# EAGLE design Badge_v0 (EAGLE 9.4.2)
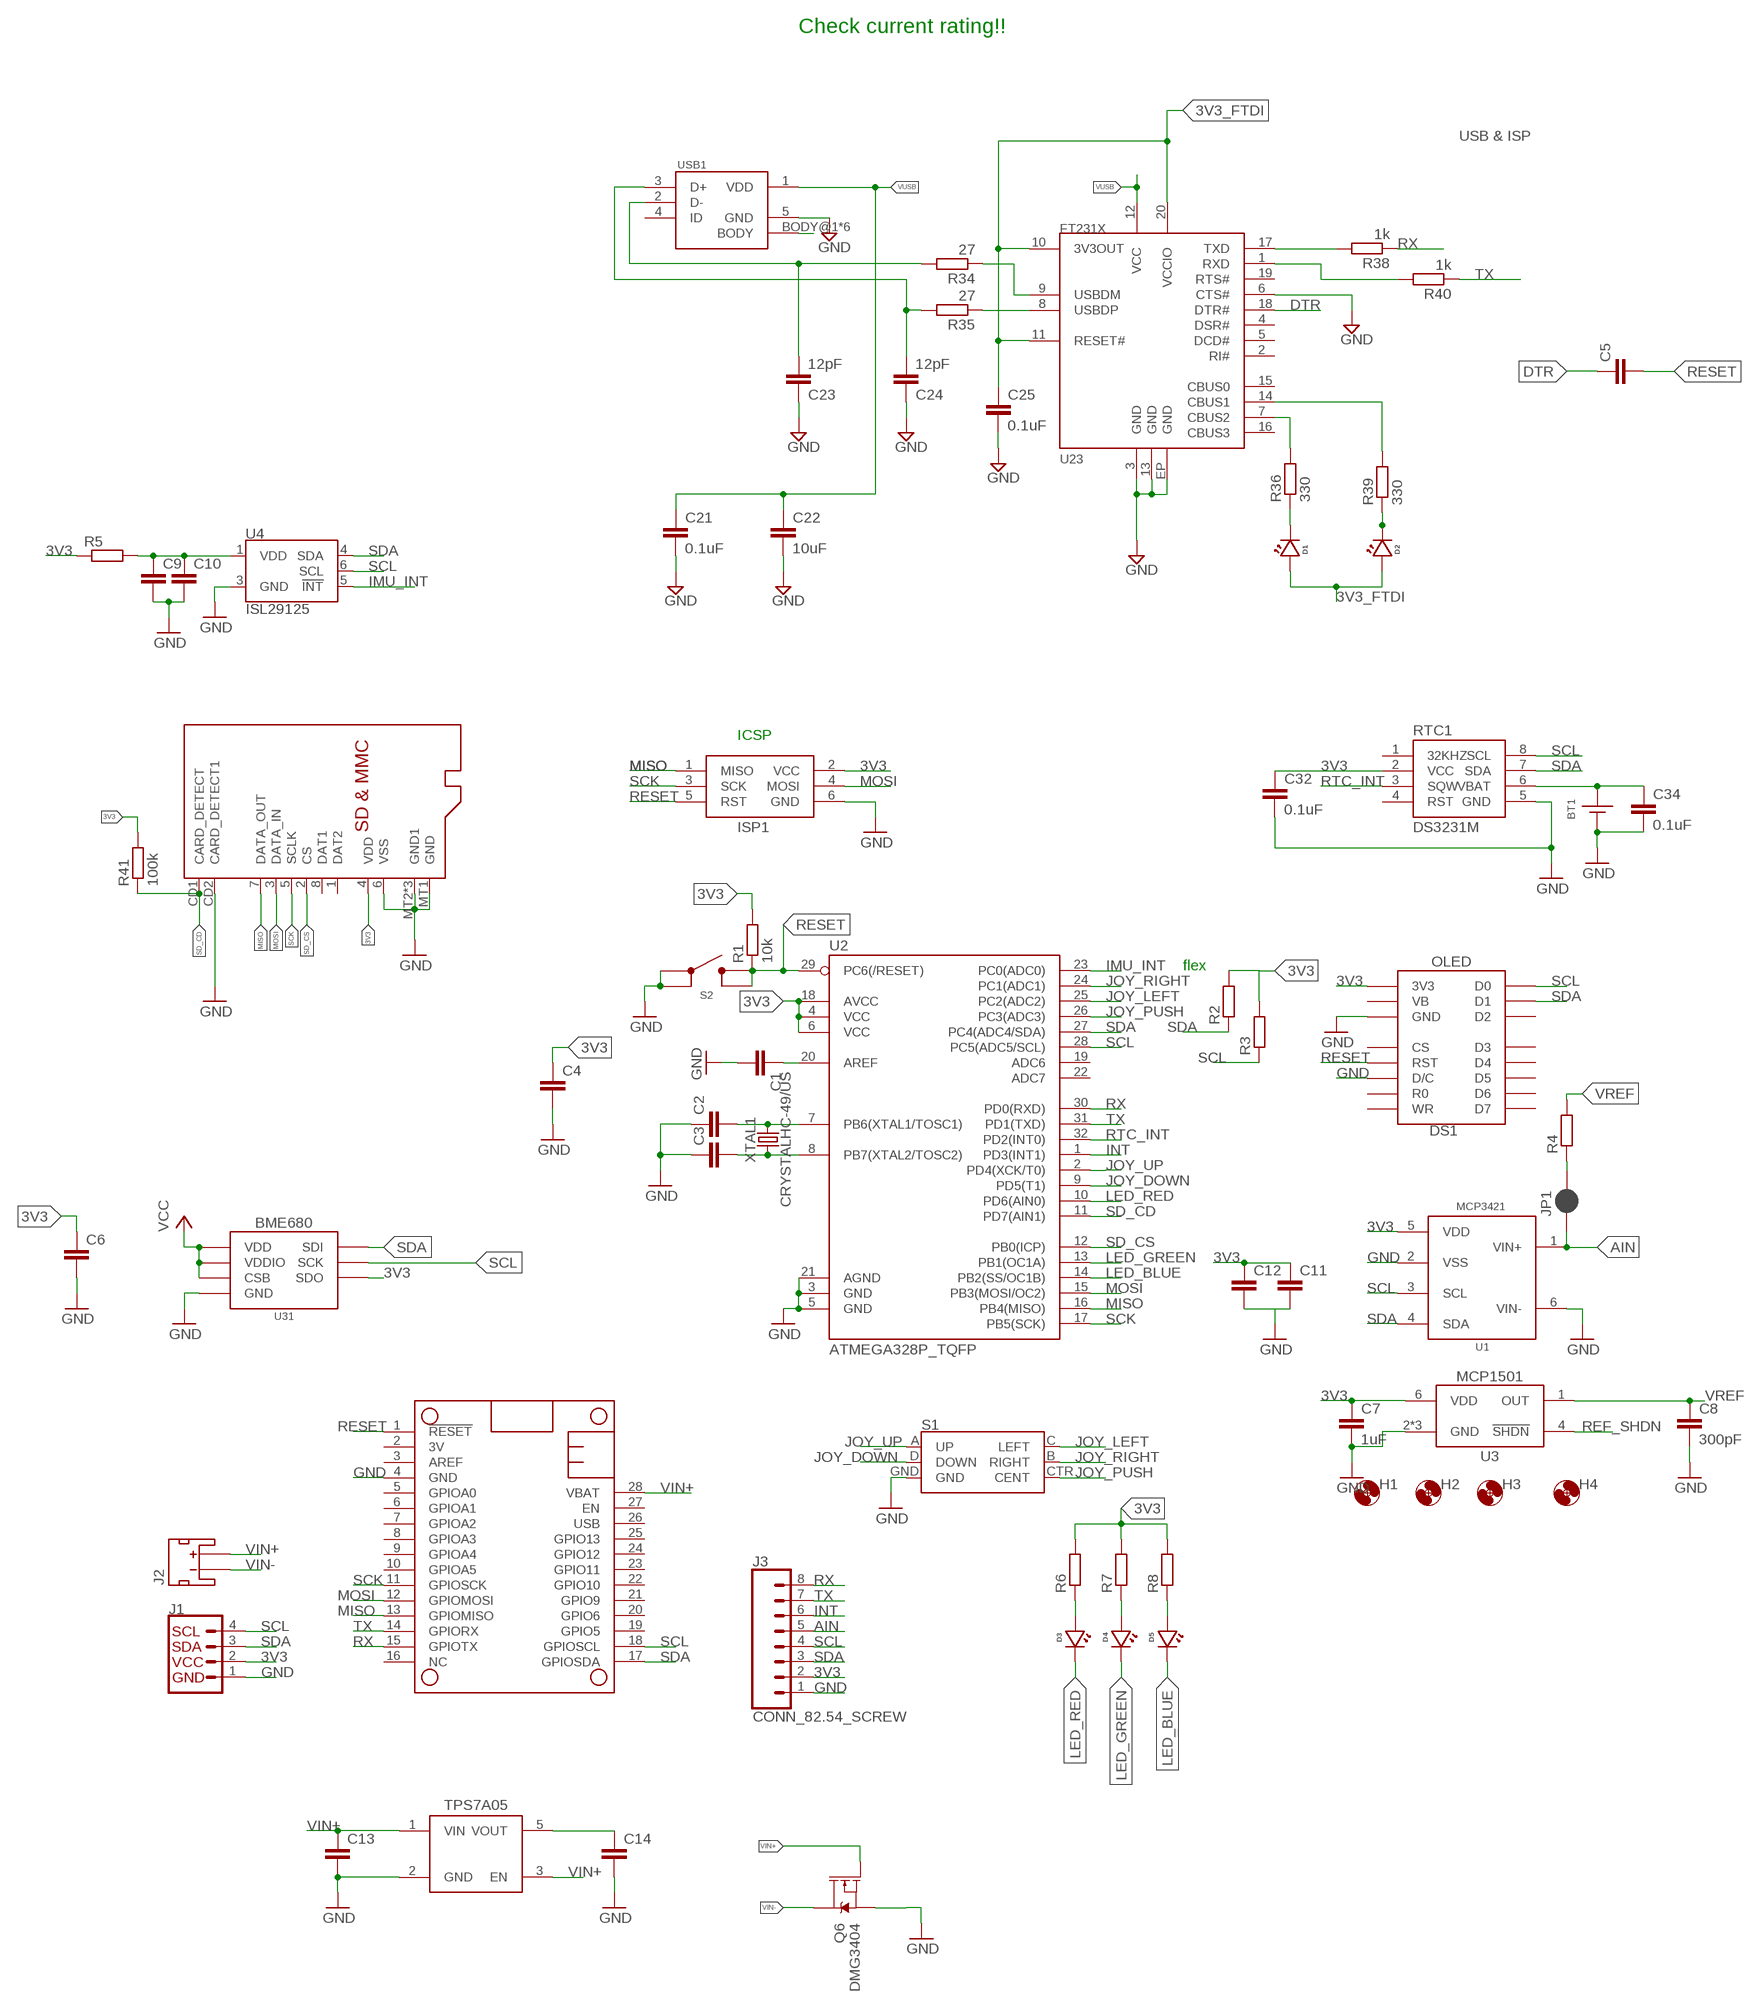
[diagram p0: schematic, sheet 1]

## Parts
BT1  BATTERY_COIN12MM  [LINX_BAT-HLD-012-SMT]
C1  C-EU0.1UFC0603  [C0603]
C2  C-EUC0603  [C0603]
C3  C-EUC0603  [C0603]
C4  C-EU1UFC0603  [C0603]
C5  C-EU0.1UFC0402  [C0402]
C6  C-EU0.1UFC0603  [C0603]
C7  1uF  C-EU1UFC0603  [C0603]
C8  300pF  C-EUC0603  [C0603]
C9  C-EU1UFC0603  [C0603]
C10  C-EU0.1UFC0603  [C0603]
C11  C-EU0.1UFC0603  [C0603]
C12  C-EU10UFC0805  [C0805]
C13  C-EU1UFC0603  [C0603]
C14  C-EU1UFC0603  [C0603]
C21  0.1uF  C-EU0.1UFC0402  [C0402]
C22  10uF  C-EU10UFC0805  [C0805]
C23  12pF  C-EU12PFC0402  [C0402]
C24  12pF  C-EU12PFC0402  [C0402]
C25  0.1uF  C-EU0.1UFC0402  [C0402]
C32  0.1uF  C-EU0.1UFC0402  [C0402]
C34  0.1uF  C-EU0.1UFC0402  [C0402]
D1  LED0402  [LED_0402]
D2  LED0402  [LED_0402]
D3  LED0402  [LED_0402]
D4  LED0402  [LED_0402]
D5  LED0402  [LED_0402]
DS1  SAPRKFUN_MICRO_OLED  [SPARKFUN_MICRO_OLED]
H1  MOUNTING_HOLE4_PL  [4_40_PLATED]
H2  MOUNTING_HOLE4_PL  [4_40_PLATED]
H3  MOUNTING_HOLE4_PL  [4_40_PLATED]
H4  MOUNTING_HOLE4_PL  [4_40_PLATED]
ISP1  AVRISP-6  [AVRISP]
J1  QWIIC_CONNECTORJS-1MM  [1X04_1MM_RA]
J2  JST_2MM_MALE  [JST-2-SMD]
J3  CONN_82.54_SCREW  [1X08_SCREW]
JP1  JUMPER-SMT_2_NC_PASTE_SILK  [SMT-JUMPER_2_NC_PASTE_SILK]
MS1  FEATHERWINGLAYOUT  [FEATHERWING_MIN]
Q6  DMG3404  MOSFET-NCH-DMG3404L  [SOT23-3]
R1  10k  R-EU_10KR0603  [R0603]
R2  R-EU_10KR0603  [R0603]
R3  R-EU_10KR0603  [R0603]
R4  R-EU_P10KR0603  [R0603]
R5  R-EU_R0603  [R0603]
R6  R-EU_330R0402  [R0402]
R7  R-EU_330R0402  [R0402]
R8  R-EU_330R0402  [R0402]
R34  27  R-EU_27R0402  [R0402]
R35  27  R-EU_27R0402  [R0402]
R36  330  R-EU_330R0402  [R0402]
R38  1k  R-EU_330R0402  [R0402]
R39  330  R-EU_330R0402  [R0402]
R40  1k  R-EU_330R0402  [R0402]
R41  100k  R-EU_10KR0402  [R0402]
RTC1  DS3231M  [SO08]
S1  JOYSTICK_MINI  [JOYSTICK_MINI]
S2  BUTTON  [SWITCH_6MM]
SD2  MICROSDCD  [MICROSD_CD]
U1  MCP3421A3  [SOT23-6L]
U2  ATMEGA328P_TQFP  ATMEGA328P_TQFPTQFP_32  [TQFP32-08]
U3  MCP15012.5V  [SOT23-6L]
U4  ISL29125  [ODFN-6]
U5  TPS7A0533DBV  [SOT23-5]
U23  FT231X-Q  [QFN20]
U31  BME680  [BMP680]
USB1  MICRO_USB_LONGPADS  [10118194-0001LF_10118194-0001LF_LONGER_PADS]
XTAL1  CRYSTALHC-49/US  [HC49UP]

## Nets
3V3: C4.1 C6.1 C7.1 C11.1 C12.1 C14.1 C32.1 DS1.VDD(3V3) ISP1.2(VCC) J1.2(VCC) J3.2 R1.2 R2.2 R3.2 R5.1 R6.2 R7.2 R8.2 R41.2 RTC1.2(VCC) SD2.4(VDD) U1.5(VDD) U2.4(VCC) U2.6(VCC) U2.18(AVCC) U3.6(VDD) U5.5(VOUT) U31.2(CSB) U31.5(SDO) U31.6(VDDIO) U31.8(VDD) ; supply symbol labelled VCC
3V3_FTDI: C25.1 D1.ANODE D2.ANODE U23.10(3V3OUT) U23.11(RESET#) U23.20(VCCIO)
AIN: J3.5 JP1.1 U1.1(VIN+)
DTR: C5.1 U23.18(DTR#)
GND: BT1.GND(-) C1.2 C2.1 C3.1 C4.2 C6.2 C7.2 C8.2 C9.2 C10.2 C11.2 C12.2 C13.2 C14.2 C21.2 C22.2 C23.1 C24.1 C25.2 C32.2 C34.2 DS1.D/C DS1.GND ISP1.6(GND) J1.1(GND) J3.1 MS1.4(GND) Q6.2(S) RTC1.5(GND) S1.GND S2.1 S2.2 SD2.6(VSS) SD2.CD2(CARD_DETECT1) SD2.MT1(GND) SD2.MT2(GND1) SD2.MT3(GND1) SD2.MT4(GND1) U1.2(VSS) U1.6(VIN-) U2.3(GND) U2.5(GND) U2.21(AGND) U3.2(GND) U3.3(GND) U3.5(GND) U4.3(GND) U5.2(GND) U23.3(GND) U23.6(CTS#) U23.13(GND) U23.EP(GND) U31.1(GND) U31.7(GND) USB1.5(GND)
IMU_INT: U2.23(PC0(ADC0)) U4.5(!INT)
INT: J3.6 U2.1(PD3(INT1))
JOY_DOWN: S1.D(DOWN) U2.9(PD5(T1))
JOY_LEFT: S1.C(LEFT) U2.25(PC2(ADC2))
JOY_PUSH: S1.CTR(CENT) U2.26(PC3(ADC3))
JOY_RIGHT: S1.B(RIGHT) U2.24(PC1(ADC1))
JOY_UP: S1.A(UP) U2.2(PD4(XCK/T0))
LED_BLUE: D5.CATHODE U2.14(PB2(SS/OC1B))
LED_GREEN: D4.CATHODE U2.13(PB1(OC1A))
LED_RED: D3.CATHODE U2.10(PD6(AIN0))
MISO: ISP1.1(MISO) MS1.13(GPIOMISO) SD2.7(DATA_OUT) U2.16(PB4(MISO))
MOSI: ISP1.4(MOSI) MS1.12(GPIOMOSI) SD2.3(DATA_IN) U2.15(PB3(MOSI/OC2))
N$1: USB1.BODY@1(BODY) USB1.BODY@2(BODY) USB1.BODY@3(BODY) USB1.BODY@4(BODY) USB1.BODY@7(BODY) USB1.BODY@8(BODY)
N$2: JP1.2 R4.1
N$3: C9.1 C10.1 R5.2 U4.1(VDD)
N$5: C1.1 U2.20(AREF)
N$7: C3.2 U2.8(PB7(XTAL2/TOSC2)) XTAL1.1
N$8: C2.2 U2.7(PB6(XTAL1/TOSC1)) XTAL1.2
N$10: D3.ANODE R6.1
N$11: D4.ANODE R7.1
N$12: D5.ANODE R8.1
N$43: BT1.POWER0(+) BT1.POWER1(+) C34.1 RTC1.6(VBAT)
N$44: R38.2 U23.17(TXD)
N$47: R40.2 U23.1(RXD)
N$48: C24.2 R35.2 USB1.3(D+)
N$49: C23.2 R34.2 USB1.2(D-)
N$50: R35.1 U23.8(USBDP)
N$51: R39.2 U23.14(CBUS1)
N$52: R34.1 U23.9(USBDM)
N$53: D2.CATHODE R39.1
N$54: D1.CATHODE R36.1
N$57: R36.2 U23.7(CBUS2)
REF_SHDN: U3.4(!SHDN)
RESET: C5.2 DS1.RESET(RST) ISP1.5(RST) MS1.1(!RESET) R1.1 S2.3 S2.4 U2.29(PC6(/RESET))
RTC_INT: RTC1.3(SQW) U2.32(PD2(INT0))
RX: J3.8 MS1.15(GPIOTX) R38.1 U2.30(PD0(RXD))
SCK: ISP1.3(SCK) MS1.11(GPIOSCK) SD2.5(SCLK) U2.17(PB5(SCK))
SCL: DS1.D0/SCK(D0) J1.4(SCL) J3.4 MS1.18(GPIOSCL) R3.1 RTC1.8(SCL) U1.3(SCL) U2.28(PC5(ADC5/SCL)) U4.6(SCL) U31.4(SCK)
SD_CD: R41.1 SD2.CD1(CARD_DETECT) U2.11(PD7(AIN1))
SD_CS: SD2.2(CS) U2.12(PB0(ICP))
SDA: DS1.D1/MOSI(D1) J1.3(SDA) J3.3 MS1.17(GPIOSDA) R2.1 RTC1.7(SDA) U1.4(SDA) U2.27(PC4(ADC4/SDA)) U4.4(SDA) U31.3(SDI)
TX: J3.7 MS1.14(GPIORX) R40.1 U2.31(PD1(TXD))
VIN+: C13.1 J2.2(+) MS1.28(VBAT) Q6.1(G) U5.1(VIN) U5.3(EN)
VIN-: J2.1(-) Q6.3(D)
VREF: C8.1 R4.2 U3.1(OUT)
VUSB: C21.1 C22.1 U23.12(VCC) USB1.1(VDD)
Unconnected: DS1.CS DS1.D2 DS1.D3 DS1.D4 DS1.D5 DS1.D6 DS1.D7 DS1.RD/E(R0) DS1.WR/RW(WR) J2.NC1(PAD1) J2.NC2(PAD2) MS1.2(3V) MS1.3(AREF) MS1.5(GPIOA0) MS1.6(GPIOA1) MS1.7(GPIOA2) MS1.8(GPIOA3) MS1.9(GPIOA4) MS1.10(GPIOA5) MS1.16(NC) MS1.19(GPIO5) MS1.20(GPIO6) MS1.21(GPIO9) MS1.22(GPIO10) MS1.23(GPIO11) MS1.24(GPIO12) MS1.25(GPIO13) MS1.26(USB) MS1.27(EN) RTC1.1(32KHZ) RTC1.4(RST) SD2.1(DAT2) SD2.8(DAT1) U2.19(ADC6) U2.22(ADC7) U23.2(RI#) U23.4(DSR#) U23.5(DCD#) U23.15(CBUS0) U23.16(CBUS3) U23.19(RTS#) USB1.4(ID)

## Notes on the sheet
- Check current rating!!
- USB & ISP
- ICSP
- flex

## Power pins joined to a net without a drawn wire
VB: DS1.VBAT(VB)

## Library data of the parts
BT1 = bschulz:BATTERY_COIN: Coin Cell Battery Holder; DIGIKEY: BAT-HLD-012-SMT-ND; MF: Linx; MPN: BAT-HLD-012-SMT
C1 C6 C10 C11 = bschulz_passives:C-EU: CAPACITOR, European symbol; DIGIKEY: 490-6051-1-ND; MF: Murata; MPN: GCM188R71E104KA57D
C2 C3 C8 = bschulz_passives:C-EU: CAPACITOR, European symbol
C4 C7 C9 C13 C14 = bschulz_passives:C-EU: CAPACITOR, European symbol; DIGIKEY: 490-10479-1-ND; MF: Murata; MPN: GRM188R61C105KA12D
C5 C21 C25 C32 C34 = bschulz_passives:C-EU: CAPACITOR, European symbol; DIGIKEY: 490-4759-1-ND; MF: Murata; MPN: GCM155R71C104KA55D
C12 C22 = bschulz_passives:C-EU: CAPACITOR, European symbol; DIGIKEY: 490-6473-6-ND; MF: Murata; MPN: GRM21BR61C106KE15K
C23 C24 = bschulz_passives:C-EU: CAPACITOR, European symbol; DIGIKEY: 445-5585-1-ND; MF: TDK; MPN: CGA2B2C0G1H120J050BA
D1-D5 = bschulz:LED: Genaric LED
DS1 = bschulz:SAPRKFUN_MICRO_OLED: Mounting for the Sparkfun Micro OLED LCD-13003 <https://www.sparkfun.com/products/13003>
H1-H4 = bschulz:MOUNTING_HOLE: Genaric Mechanical Mounting Hole Hole diameter based on max body diameter + 15% Keepout ring is for diameter of socket cap screw (minimum required clearance) TPlace ring is for diameter of pan head screw (recomended clearance) Specifications: Socket Cap <http://fastener-express.com/fastener-technical/SocketscapSS-Alloy.pdf> Button Head Socket Cap <http://fastener-express.com/fastener-technical/Button-Socket-alloy.pdf> Pan Head <http://fastener-express.com/fastener-technical/pan-machine-Screws.pdf>
ISP1 = bschulz:AVRISP: AVR ISP HEADER Standard 6 pin header for AVR programming; DIGIKEY: 609-3234-ND; MF: Amphenol; MPN: 67997-206HLF
J1 = SparkFun-Connectors:QWIIC_CONNECTOR: SparkFun I2C Standard Qwiic Connector An SMD 1mm pitch JST connector makes it easy and quick (get it? Qwiic?) to connect I2C devices to each other. The Qwiic system <http://www.sparkfun.com/qwiic> enables fast and solderless connection between popular platforms and various sensors and actuators. We carry 200mm <https://www.sparkfun.com/products/14204>, 100mm <https://www.sparkfun.com/products/14205>, 50mm <https://www.sparkfun.com/products/14206>, and breadboard friendly <https://www.sparkfun.com/products/14207> Qwiic cables. We also offer 10 pcs strips <https://www.sparkfun.com/products/14323> the SMD connectors.
J2 = bschulz:JST_2MM_MALE: JST 2MM MALE RA CONNECTOR Two pin, compact surface mount connector. Commonly used as a battery input connection point. We really like the solid locking feeling and high current rating on these small connectors. We use these all the time as battery connectors. Mates to single-cell LiPo batteries. Here is the connector we sell at SparkFun: JST Right Angle Connector - White <https://www.sparkfun.com/products/8612> (PRT-08612) Datasheet <http://www.sparkfun.com/datasheets/Prototyping/Connectors/JST-Horizontal.pdf> It was used on these SparkFun products: SparkFun MOSFET Power Controller <https://www.sparkfun.com/products/11214> (PRT-11214) SparkFun Battery Babysitter - LiPo Battery Manager <https://www.sparkfun.com/products/13777> (PRT-13777) And many, many others that required a lipo battery connection.; DIGIKEY: 455-1749-1-ND; MF: JST; MPN: S2B-PH-SM4-TB(LF)(SN)
J3 = bschulz:CONN_8: Genaric 8 terminal header Digikey 2.54_SCREW <https://www.digikey.com/product-detail/en/on-shore-technology-inc/OSTVN06A150/ED10565-ND/1588866>; DIGIKEY: ED10566-ND; MF: On Shore; MPN: OSTVN08A150
JP1 = SparkFun-Jumpers:JUMPER-SMT_2_NC_PASTE: Normally closed solder jumper This jumper has an aperture in the stencil to allow solder paste to bridge the split in the wire so it's normally closed (NC). Wick off the solder to open the connection. Reapply solder to reclose the connection.
MS1 = bschulz:FEATHERWING
Q6 = bschulz:MOSFET-NCH: N-channel MOSFETs Voltage controlled devices that allow control of high current outputs. SparkFun Products: SparkFun OpenScale <https://www.sparkfun.com/products/13261> SparkFun Digital Sandbox <https://www.sparkfun.com/products/12651> SparkFun Monster Moto Shield <https://www.sparkfun.com/products/10182> SparkFun MOSFET Power Controller <https://www.sparkfun.com/products/11214>; DIGIKEY: DMG3404L-7DICT-ND; MF: Diodes Incorporated; MPN: DMG3404L-7
R1-R3 R41 = bschulz_passives:R-EU_: RESISTOR, European symbol Digikey Parts: Yageo, 0402 <https://www.digikey.com/products/en/resistors/chip-resistor-surface-mount/52?k=&pkeyword=&sf=0&FV=ffec1104%2Cfffc000d%2C1c0002%2C440067%2C1f140000%2Cffe00034%2C400004&quantity=&ColumnSort=0&page=1&stock=1&pageSize=25> Yageo, 0603 <https://www.digikey.com/products/en/resistors/chip-resistor-surface-mount/52?k=&pkeyword=&s=4356&s=47360&sf=0&FV=fffc000d%2C1c0002%2C142c040c%2C1f140000%2Cffe00034&quantity=10&ColumnSort=1000011&page=1&stock=1&pageSize=25> Panasonic, 0603 <https://www.digikey.com/products/en/resistors/chip-resistor-surface-mount/52?k=&pkeyword=&pv252=68&sf=0&FV=ffec373d%2C1c0002%2C142c040c%2C1f140000%2Cffe00034%2C80002%2Cc0001&quantity=&ColumnSort=0&page=1&stock=1&pageSize=25> Panasonic, precision, 0603 <https://www.digikey.com/products/en/resistors/chip-resistor-surface-mount/52?FV=ffec4907%2Cfffc000a%2Cc0172%2C142c040c%2C1f140000%2Cffe00034%2C1c0002&quantity=100&ColumnSort=2085&page=1&stock=1&pageSize=25> Panasonic, 0805 <https://www.digikey.com/products/en/resistors/chip-resistor-surface-mount/52?k=&pkeyword=&pv3=1&sf=0&FV=ffec373d%2C1c0002%2C1f140000%2Cffe00034%2C142c040d&quantity=&ColumnSort=0&page=1&stock=1&pageSize=25> Rohm, current sense <https://www.digikey.com/products/en/resistors/chip-resistor-surface-mount/52?k=&pkeyword=&pv3=1&sf=0&FV=ffecb688%2C1f140000%2Cffe00034%2C1c0002&quantity=&ColumnSort=0&page=1&stock=1&pageSize=25> Vishay, pulse proof automotive <https://www.digikey.com/products/en/resistors/chip-resistor-surface-mount/52?k=&pkeyword=&pv7=2&sf=0&FV=ffec5d6b%2Cffe00034%2C1f140000&quantity=&ColumnSort=0&page=1&stock=1&pageSize=25>; DIGIKEY: 311-10.0KHRCT-ND; MF: Yageo; MPN: RC0603FR-0710KL; VALUE_PART: 10k
R4 = bschulz_passives:R-EU_: RESISTOR, European symbol Digikey Parts: Yageo, 0402 <https://www.digikey.com/products/en/resistors/chip-resistor-surface-mount/52?k=&pkeyword=&sf=0&FV=ffec1104%2Cfffc000d%2C1c0002%2C440067%2C1f140000%2Cffe00034%2C400004&quantity=&ColumnSort=0&page=1&stock=1&pageSize=25> Yageo, 0603 <https://www.digikey.com/products/en/resistors/chip-resistor-surface-mount/52?k=&pkeyword=&s=4356&s=47360&sf=0&FV=fffc000d%2C1c0002%2C142c040c%2C1f140000%2Cffe00034&quantity=10&ColumnSort=1000011&page=1&stock=1&pageSize=25> Panasonic, 0603 <https://www.digikey.com/products/en/resistors/chip-resistor-surface-mount/52?k=&pkeyword=&pv252=68&sf=0&FV=ffec373d%2C1c0002%2C142c040c%2C1f140000%2Cffe00034%2C80002%2Cc0001&quantity=&ColumnSort=0&page=1&stock=1&pageSize=25> Panasonic, precision, 0603 <https://www.digikey.com/products/en/resistors/chip-resistor-surface-mount/52?FV=ffec4907%2Cfffc000a%2Cc0172%2C142c040c%2C1f140000%2Cffe00034%2C1c0002&quantity=100&ColumnSort=2085&page=1&stock=1&pageSize=25> Panasonic, 0805 <https://www.digikey.com/products/en/resistors/chip-resistor-surface-mount/52?k=&pkeyword=&pv3=1&sf=0&FV=ffec373d%2C1c0002%2C1f140000%2Cffe00034%2C142c040d&quantity=&ColumnSort=0&page=1&stock=1&pageSize=25> Rohm, current sense <https://www.digikey.com/products/en/resistors/chip-resistor-surface-mount/52?k=&pkeyword=&pv3=1&sf=0&FV=ffecb688%2C1f140000%2Cffe00034%2C1c0002&quantity=&ColumnSort=0&page=1&stock=1&pageSize=25> Vishay, pulse proof automotive <https://www.digikey.com/products/en/resistors/chip-resistor-surface-mount/52?k=&pkeyword=&pv7=2&sf=0&FV=ffec5d6b%2Cffe00034%2C1f140000&quantity=&ColumnSort=0&page=1&stock=1&pageSize=25>; DIGIKEY: P10KDBCT-ND; MF: Panasonic; MPN: ERA-3AEB103V; VALUE_PART: 10k
R5 = bschulz_passives:R-EU_: RESISTOR, European symbol Digikey Parts: Yageo, 0402 <https://www.digikey.com/products/en/resistors/chip-resistor-surface-mount/52?k=&pkeyword=&sf=0&FV=ffec1104%2Cfffc000d%2C1c0002%2C440067%2C1f140000%2Cffe00034%2C400004&quantity=&ColumnSort=0&page=1&stock=1&pageSize=25> Yageo, 0603 <https://www.digikey.com/products/en/resistors/chip-resistor-surface-mount/52?k=&pkeyword=&s=4356&s=47360&sf=0&FV=fffc000d%2C1c0002%2C142c040c%2C1f140000%2Cffe00034&quantity=10&ColumnSort=1000011&page=1&stock=1&pageSize=25> Panasonic, 0603 <https://www.digikey.com/products/en/resistors/chip-resistor-surface-mount/52?k=&pkeyword=&pv252=68&sf=0&FV=ffec373d%2C1c0002%2C142c040c%2C1f140000%2Cffe00034%2C80002%2Cc0001&quantity=&ColumnSort=0&page=1&stock=1&pageSize=25> Panasonic, precision, 0603 <https://www.digikey.com/products/en/resistors/chip-resistor-surface-mount/52?FV=ffec4907%2Cfffc000a%2Cc0172%2C142c040c%2C1f140000%2Cffe00034%2C1c0002&quantity=100&ColumnSort=2085&page=1&stock=1&pageSize=25> Panasonic, 0805 <https://www.digikey.com/products/en/resistors/chip-resistor-surface-mount/52?k=&pkeyword=&pv3=1&sf=0&FV=ffec373d%2C1c0002%2C1f140000%2Cffe00034%2C142c040d&quantity=&ColumnSort=0&page=1&stock=1&pageSize=25> Rohm, current sense <https://www.digikey.com/products/en/resistors/chip-resistor-surface-mount/52?k=&pkeyword=&pv3=1&sf=0&FV=ffecb688%2C1f140000%2Cffe00034%2C1c0002&quantity=&ColumnSort=0&page=1&stock=1&pageSize=25> Vishay, pulse proof automotive <https://www.digikey.com/products/en/resistors/chip-resistor-surface-mount/52?k=&pkeyword=&pv7=2&sf=0&FV=ffec5d6b%2Cffe00034%2C1f140000&quantity=&ColumnSort=0&page=1&stock=1&pageSize=25>; MF: Yageo
R6-R8 = bschulz_passives:R-EU_: RESISTOR, European symbol Digikey Parts: Yageo, 0402 <https://www.digikey.com/products/en/resistors/chip-resistor-surface-mount/52?k=&pkeyword=&sf=0&FV=ffec1104%2Cfffc000d%2C1c0002%2C440067%2C1f140000%2Cffe00034%2C400004&quantity=&ColumnSort=0&page=1&stock=1&pageSize=25> Yageo, 0603 <https://www.digikey.com/products/en/resistors/chip-resistor-surface-mount/52?k=&pkeyword=&s=4356&s=47360&sf=0&FV=fffc000d%2C1c0002%2C142c040c%2C1f140000%2Cffe00034&quantity=10&ColumnSort=1000011&page=1&stock=1&pageSize=25> Panasonic, 0603 <https://www.digikey.com/products/en/resistors/chip-resistor-surface-mount/52?k=&pkeyword=&pv252=68&sf=0&FV=ffec373d%2C1c0002%2C142c040c%2C1f140000%2Cffe00034%2C80002%2Cc0001&quantity=&ColumnSort=0&page=1&stock=1&pageSize=25> Panasonic, precision, 0603 <https://www.digikey.com/products/en/resistors/chip-resistor-surface-mount/52?FV=ffec4907%2Cfffc000a%2Cc0172%2C142c040c%2C1f140000%2Cffe00034%2C1c0002&quantity=100&ColumnSort=2085&page=1&stock=1&pageSize=25> Panasonic, 0805 <https://www.digikey.com/products/en/resistors/chip-resistor-surface-mount/52?k=&pkeyword=&pv3=1&sf=0&FV=ffec373d%2C1c0002%2C1f140000%2Cffe00034%2C142c040d&quantity=&ColumnSort=0&page=1&stock=1&pageSize=25> Rohm, current sense <https://www.digikey.com/products/en/resistors/chip-resistor-surface-mount/52?k=&pkeyword=&pv3=1&sf=0&FV=ffecb688%2C1f140000%2Cffe00034%2C1c0002&quantity=&ColumnSort=0&page=1&stock=1&pageSize=25> Vishay, pulse proof automotive <https://www.digikey.com/products/en/resistors/chip-resistor-surface-mount/52?k=&pkeyword=&pv7=2&sf=0&FV=ffec5d6b%2Cffe00034%2C1f140000&quantity=&ColumnSort=0&page=1&stock=1&pageSize=25>; DIGIKEY: 311-330LRCT-ND; MF: Yageo; MPN: RC0402FR-07330RL; VALUE_PART: 330
R34 R35 = bschulz_passives:R-EU_: RESISTOR, European symbol Digikey Parts: Yageo, 0402 <https://www.digikey.com/products/en/resistors/chip-resistor-surface-mount/52?k=&pkeyword=&sf=0&FV=ffec1104%2Cfffc000d%2C1c0002%2C440067%2C1f140000%2Cffe00034%2C400004&quantity=&ColumnSort=0&page=1&stock=1&pageSize=25> Yageo, 0603 <https://www.digikey.com/products/en/resistors/chip-resistor-surface-mount/52?k=&pkeyword=&s=4356&s=47360&sf=0&FV=fffc000d%2C1c0002%2C142c040c%2C1f140000%2Cffe00034&quantity=10&ColumnSort=1000011&page=1&stock=1&pageSize=25> Panasonic, 0603 <https://www.digikey.com/products/en/resistors/chip-resistor-surface-mount/52?k=&pkeyword=&pv252=68&sf=0&FV=ffec373d%2C1c0002%2C142c040c%2C1f140000%2Cffe00034%2C80002%2Cc0001&quantity=&ColumnSort=0&page=1&stock=1&pageSize=25> Panasonic, precision, 0603 <https://www.digikey.com/products/en/resistors/chip-resistor-surface-mount/52?FV=ffec4907%2Cfffc000a%2Cc0172%2C142c040c%2C1f140000%2Cffe00034%2C1c0002&quantity=100&ColumnSort=2085&page=1&stock=1&pageSize=25> Panasonic, 0805 <https://www.digikey.com/products/en/resistors/chip-resistor-surface-mount/52?k=&pkeyword=&pv3=1&sf=0&FV=ffec373d%2C1c0002%2C1f140000%2Cffe00034%2C142c040d&quantity=&ColumnSort=0&page=1&stock=1&pageSize=25> Rohm, current sense <https://www.digikey.com/products/en/resistors/chip-resistor-surface-mount/52?k=&pkeyword=&pv3=1&sf=0&FV=ffecb688%2C1f140000%2Cffe00034%2C1c0002&quantity=&ColumnSort=0&page=1&stock=1&pageSize=25> Vishay, pulse proof automotive <https://www.digikey.com/products/en/resistors/chip-resistor-surface-mount/52?k=&pkeyword=&pv7=2&sf=0&FV=ffec5d6b%2Cffe00034%2C1f140000&quantity=&ColumnSort=0&page=1&stock=1&pageSize=25>; DIGIKEY: YAG3086CT-ND; MF: Yageo; MPN: RC0402FR-0727RL; VALUE_PART: 27
R36 R38 R40 = bschulz_passives:R-EU_: RESISTOR, European symbol Digikey Parts: Yageo, 0402 <https://www.digikey.com/products/en/resistors/chip-resistor-surface-mount/52?k=&pkeyword=&sf=0&FV=ffec1104%2Cfffc000d%2C1c0002%2C440067%2C1f140000%2Cffe00034%2C400004&quantity=&ColumnSort=0&page=1&stock=1&pageSize=25> Yageo, 0603 <https://www.digikey.com/products/en/resistors/chip-resistor-surface-mount/52?k=&pkeyword=&s=4356&s=47360&sf=0&FV=fffc000d%2C1c0002%2C142c040c%2C1f140000%2Cffe00034&quantity=10&ColumnSort=1000011&page=1&stock=1&pageSize=25> Panasonic, 0603 <https://www.digikey.com/products/en/resistors/chip-resistor-surface-mount/52?k=&pkeyword=&pv252=68&sf=0&FV=ffec373d%2C1c0002%2C142c040c%2C1f140000%2Cffe00034%2C80002%2Cc0001&quantity=&ColumnSort=0&page=1&stock=1&pageSize=25> Panasonic, precision, 0603 <https://www.digikey.com/products/en/resistors/chip-resistor-surface-mount/52?FV=ffec4907%2Cfffc000a%2Cc0172%2C142c040c%2C1f140000%2Cffe00034%2C1c0002&quantity=100&ColumnSort=2085&page=1&stock=1&pageSize=25> Panasonic, 0805 <https://www.digikey.com/products/en/resistors/chip-resistor-surface-mount/52?k=&pkeyword=&pv3=1&sf=0&FV=ffec373d%2C1c0002%2C1f140000%2Cffe00034%2C142c040d&quantity=&ColumnSort=0&page=1&stock=1&pageSize=25> Rohm, current sense <https://www.digikey.com/products/en/resistors/chip-resistor-surface-mount/52?k=&pkeyword=&pv3=1&sf=0&FV=ffecb688%2C1f140000%2Cffe00034%2C1c0002&quantity=&ColumnSort=0&page=1&stock=1&pageSize=25> Vishay, pulse proof automotive <https://www.digikey.com/products/en/resistors/chip-resistor-surface-mount/52?k=&pkeyword=&pv7=2&sf=0&FV=ffec5d6b%2Cffe00034%2C1f140000&quantity=&ColumnSort=0&page=1&stock=1&pageSize=25>; DIGIKEY: 311-330LRCT-ND; MF: Yageo; MPN: RC0603FR-07330RL; VALUE_PART: 330
R39 = bschulz_passives:R-EU_: RESISTOR, European symbol Digikey Parts: Yageo, 0402 <https://www.digikey.com/products/en/resistors/chip-resistor-surface-mount/52?k=&pkeyword=&sf=0&FV=ffec1104%2Cfffc000d%2C1c0002%2C440067%2C1f140000%2Cffe00034%2C400004&quantity=&ColumnSort=0&page=1&stock=1&pageSize=25> Yageo, 0603 <https://www.digikey.com/products/en/resistors/chip-resistor-surface-mount/52?k=&pkeyword=&s=4356&s=47360&sf=0&FV=fffc000d%2C1c0002%2C142c040c%2C1f140000%2Cffe00034&quantity=10&ColumnSort=1000011&page=1&stock=1&pageSize=25> Panasonic, 0603 <https://www.digikey.com/products/en/resistors/chip-resistor-surface-mount/52?k=&pkeyword=&pv252=68&sf=0&FV=ffec373d%2C1c0002%2C142c040c%2C1f140000%2Cffe00034%2C80002%2Cc0001&quantity=&ColumnSort=0&page=1&stock=1&pageSize=25> Panasonic, precision, 0603 <https://www.digikey.com/products/en/resistors/chip-resistor-surface-mount/52?FV=ffec4907%2Cfffc000a%2Cc0172%2C142c040c%2C1f140000%2Cffe00034%2C1c0002&quantity=100&ColumnSort=2085&page=1&stock=1&pageSize=25> Panasonic, 0805 <https://www.digikey.com/products/en/resistors/chip-resistor-surface-mount/52?k=&pkeyword=&pv3=1&sf=0&FV=ffec373d%2C1c0002%2C1f140000%2Cffe00034%2C142c040d&quantity=&ColumnSort=0&page=1&stock=1&pageSize=25> Rohm, current sense <https://www.digikey.com/products/en/resistors/chip-resistor-surface-mount/52?k=&pkeyword=&pv3=1&sf=0&FV=ffecb688%2C1f140000%2Cffe00034%2C1c0002&quantity=&ColumnSort=0&page=1&stock=1&pageSize=25> Vishay, pulse proof automotive <https://www.digikey.com/products/en/resistors/chip-resistor-surface-mount/52?k=&pkeyword=&pv7=2&sf=0&FV=ffec5d6b%2Cffe00034%2C1f140000&quantity=&ColumnSort=0&page=1&stock=1&pageSize=25>; DIGIKEY: 311-330HRCT-ND; MF: Yageo; MPN: RC0603FR-07330RL; VALUE_PART: 330
RTC1 = bschulz:DS3231M: DS3231M Real Time Clock Accuracy +/-5ppm. Battery Backup. 2.3V to 5.5V. Datasheet <https://cdn.sparkfun.com/datasheets/Dev/Beagle/DS3231M.pdf> SparkFun Products CryptoCape <https://www.sparkfun.com/products/12773> (DEV-12773) SparkFun CryptoShield <https://www.sparkfun.com/products/13183> (DEV-13183); DIGIKEY: DS3231MZ+-ND; MF: Maxim; MPN: DS3231MZ+
S1 = SparkFun-Switches:JOYSTICK_MINI: Small Tactile Joystick w/ Select Switch A 5-way tactile switch allows for a joystick-like interface in a very small package. Part #: 4UCON SF303GJ26 SparkFun Products 5-way Tactile Switch <https://www.sparkfun.com/products/10063> (COM-10063) Used on SparkFun Block for Intel® Edison - OLED <https://www.sparkfun.com/products/13035> (DEV-13035) Used on CAN-BUS Shield <https://www.sparkfun.com/products/13262> (DEV-13262); PROD_ID: SWCH-09905; SF_SKU: COM-10063
S2 = bschulz:BUTTON: Genaric SPST Pushbutton
SD2 = bschulz:MICROSD: Micro-SD / Transflash card holder with SPI pinout For the 3M # 2908-05WB-MG and/or 4UCON #19656 push-push type; DIGIKEY: WM19093CT-ND; MF: Molex; MPN: 5025700893
U1 = bschulz:MCP342*: MCP342* - Sigma Delta ADC Characteristics: VCC: 2.7~5.5V Operating Temperature: -40°C to 125°C Number of Inputs: 1 (Differenital) Sample Rate: 15 Samples Per Second Number of Bits: 16 (MCP3425), 18 (MCP3421) Digikey: MCP3421 MCP3425A0T-E/CHCT-ND <https://www.digikey.com/product-detail/en/microchip-technology/MCP3425A0T-E-CH/MCP3425A0T-E-CHCT-ND/1979810> MCP3425 MCP3421A0T-E/CHCT-ND <https://www.digikey.com/product-detail/en/microchip-technology/MCP3421A0T-E-CH/MCP3421A0T-E-CHCT-ND/2183406> MCP3421A1T-E/CHCT-ND <https://www.digikey.com/product-detail/en/microchip-technology/MCP3421A1T-E-CH/MCP3421A1T-E-CHCT-ND/2183407> MCP3421A3T-E/CHCT-ND <https://www.digikey.com/product-detail/en/microchip-technology/MCP3421A3T-E-CH/MCP3421A3T-E-CHCT-ND/2183409>; DIGIKEY: MCP3421A3T-E/CHCT-ND; DISP: MCP3421; MF: Microchip; MPN: MCP3421A3T-E/CH
U2 = bschulz:ATMEGA328P_TQFP: Popular 328P in QFP Storefront component: ATmega328 - TQFP <https://www.sparkfun.com/products/13448> (COM-13448) Datasheet <http://www.sparkfun.com/datasheets/Components/SMD/ATMega328.pdf> SparkFun Products SparkFun RedBoard - Programmed with Arduino <https://www.sparkfun.com/products/12757> (DEV-12757) Arduino Pro Mini 328 - 5V/16MHz <https://www.sparkfun.com/products/11113> (DEV-11113) Arduino Pro Mini 328 - 3.3V/8MHz <https://www.sparkfun.com/products/11114> (DEV-11114) SparkFun OpenLog <https://www.sparkfun.com/products/13712> (DEV-13712) SparkFun MicroView - OLED Arduino Module <https://www.sparkfun.com/products/12923> (DEV-12923) SparkFun Digital Sandbox <https://www.sparkfun.com/products/12651> (DEV-12651) SparkFun PicoBoard <https://www.sparkfun.com/products/11888> (WIG-11888) Arduino Fio <https://www.sparkfun.com/products/10116> (DEV-10116) LilyPad Arduino 328 Main Board <https://www.sparkfun.com/products/13342> (DEV-13342) SparkFun RedStick <https://www.sparkfun.com/products/13741> (DEV-13741) LilyPad MP3 <https://www.sparkfun.com/products/11013> (DEV-11013) LilyPad Arduino SimpleSnap <https://www.sparkfun.com/products/10941> (DEV-10941) SparkFun Stepoko <https://www.sparkfun.com/products/13899> (ROB-13899) SparkFun Geiger Counter <https://www.sparkfun.com/products/11345> (SEN-11345) SparkFun EL Sequencer <https://www.sparkfun.com/products/12781> (COM-12781) Arduino Pro 328 - 5V/16MHz <https://www.sparkfun.com/products/10915> (DEV-10915) CryptoCape <https://www.sparkfun.com/products/12773> (DEV-12773) SparkFun IR Thermometer Evaluation Board - MLX90614 <https://www.sparkfun.com/products/10740> (SEN-10740) SparkFun RedBot Mainboard <https://www.sparkfun.com/products/12097> (ROB-12097) Arduino Pro 328 - 3.3V/8MHz <https://www.sparkfun.com/products/10914> (DEV-10914) SparkFun Block for Intel® Edison - Arduino <https://www.sparkfun.com/products/13036> (DEV-13036) SparkFun Simon Says - Surface Mount Soldering Kit <https://www.sparkfun.com/products/10935> (KIT-10935) SparkFun 7-Segment Serial Display - Red <https://www.sparkfun.com/products/11441> (COM-11441) SparkFun 7-Segment Serial Display - White <https://www.sparkfun.com/products/11629> (COM-11629) SparkFun 7-Segment Serial Display - Yellow <https://www.sparkfun.com/products/11443> (COM-11443) SparkFun 7-Segment Serial Display - Kelly Green <https://www.sparkfun.com/products/11440> (COM-11440) SparkFun 7-Segment Serial Display - Blue <https://www.sparkfun.com/products/11442> (COM-11442) SparkFun OpenSegment Serial Display - 20mm (Blue) <https://www.sparkfun.com/products/11647> (COM-11647) SparkFun OpenSegment Serial Display - 20mm (Green) <https://www.sparkfun.com/products/11646> (COM-11646) SparkFun OpenSegment Serial Display - 20mm (White) <https://www.sparkfun.com/products/11648> (COM-11648) SparkFun OpenSegment Serial Display - 20mm (Red) <https://www.sparkfun.com/products/11644> (COM-11644) SparkFun OpenSegment Serial Display - 20mm (Yellow) <https://www.sparkfun.com/products/11645> (COM-11645) SparkFun OpenSegment Shield <https://www.sparkfun.com/products/13190> (DEV-13190); DIGIKEY: ATMEGA328PB-AURCT-ND; MF: Atmel; MPN: ATMEGA328PB-AUR; PROD_ID: IC-09069
U3 = bschulz:MCP1501: MCP1501 - Low Power Voltage Referance with Shutdown Characteristics: Vin: Vout + 0.2v ~ 5.5V Vout: 1.024V ~ 4.096V IQ: 140μA Iout: 20mA Tolerance: ± 0.1% Operating Temperature: -40°C to 125°C Digikey: MCP1501T-25E/CHYCT-ND (2.5v) <https://www.digikey.com/product-detail/en/microchip-technology/MCP1501T-25E-CHY/MCP1501T-25E-CHYCT-ND/5844631>; DIGIKEY: MCP1501T-25E/CHYCT-ND; MF: Microchip; MPN: MCP1501T-25E/CHY
U4 = SparkFun-Sensors:ISL29125: Intersil ISL29125 RGB Color Light Sensor The ISL29125 is a low power, high sensitivity, RED, GREEN and BLUE color light sensor (RGB) with an I2C (SMBus compatible) interface. Its state-of-the-art photodiode array provides an accurate RGB spectral response and excellent light source to light source variation (LS2LS). Datasheet <https://cdn.sparkfun.com/datasheets/Sensors/LightImaging/isl29125.pdf> SparkFun Products SparkFun RGB Light Sensor - ISL29125 <https://www.sparkfun.com/products/12829> (SEN-12829); PROD_ID: IC-12055
U5 = bschulz:TPS7A05*: TPS7A05* - Ultra Low Power Low Dropout Linear Regulator Characteristics: Vin: 1.4V ~ 5.5V Vout: 0.8, 1.0, 1.2, 1.5, 1.8, 2.5, 2.85, 3.3V fixed IQ: 1μA typ, 3μA max Voltage Accuracy: 1% typ, 3% max Output Current: 200 mA Operating Temperature: -40°C to 125°C Mouser: TPS7A0533 (3.3V Fixed) <https://www.mouser.com/ProductDetail/Texas-Instruments/TPS7A0533PDBVR?qs=sGAEpiMZZMsGz1a6aV8DcD1rpA6FsR3J1Mp5DdTpiXw%3d> TPS7A0518 (1.8V Fixed) <https://www.mouser.com/ProductDetail/Texas-Instruments/TPS7A0518PDBVR?qs=sGAEpiMZZMsGz1a6aV8DcD1rpA6FsR3J1f7DNYacdSI%3d>; DIGIKEY: 296-50256-1-ND; MF: TI; MOUSER: 595-TPS7A0533PDBVR; MPN: TPS7A0533PDBVR
U23 = bschulz:FT231X: FT231x - USB to UART Bridge Characteristics: Vin: 3.3V ~ 5V Operating Temperature: -40°C to 85°C Digikey: FT231x <https://www.digikey.com/product-detail/en/ftdi-future-technology-devices-international-ltd/FT231XQ-R/768-1128-1-ND/3029153>; DIGIKEY: 768-1128-1-ND; MF: FTDI; MPN: FT231XQ-R
U31 = bschulz:BME680: BME680 - Low power gas, pressure, tempurature, humidity sensor Characteristics: Vcc: 1.8V ~ 3.3V Pressure Range: 300 ~ 1100 mBar Pressure Resolution: 0.0015 mBar, max Pressure Accuracy: relative ±0.12 mBar, abs ± 1 mBar Humidity Resolution: 0.008% RH, max Humidity Accuracy: ±3% RH Temperature Resolution: 0.01°C Temperature Accuracy: 0.5°C Gas Response Time: <1s Gas Sensor Output: IAQ Index Operating Temperature: -40°C to 85°C Digikey: 828-1077-1-ND <https://www.digikey.com/product-detail/en/bosch-sensortec/BME680/828-1077-1-ND/7401321>; DIGIKEY: 828-1077-1-ND; DISP: BME680; MF: Bosch; MPN: BME680
USB1 = bschulz:MICRO_USB_LONGPADS; DIGIKEY: 609-4618-1-ND; MF: Amphenol; MPN: 10118194-0001LF
XTAL1 = bschulz:CRYSTAL: Crystal Oscilator 2 Pin quartz crystal oscilators Variants 3.2x1.5mm (Only available in 32.768kHz) <https://www.digikey.com/products/en/crystals-oscillators-resonators/crystals/171?FV=b839bf%2Cb83a33%2C8640001%2C864000f%2C8640003%2C1f140000%2Cmu32.768kHz%7C2150%2Cffe000ab&quantity=10&ColumnSort=1000011&page=1&stock=1&k=crystal&pageSize=25&pkeyword=crystal> 5 x 3.2mm (8MHz ~ 50MHz) <https://www.digikey.com/products/en/crystals-oscillators-resonators/crystals/171?FV=402f3e%2Cb8434d%2C1f140000%2Cffe000ab&quantity=10&ColumnSort=1000011&page=1&stock=1&pageSize=25>

## Board
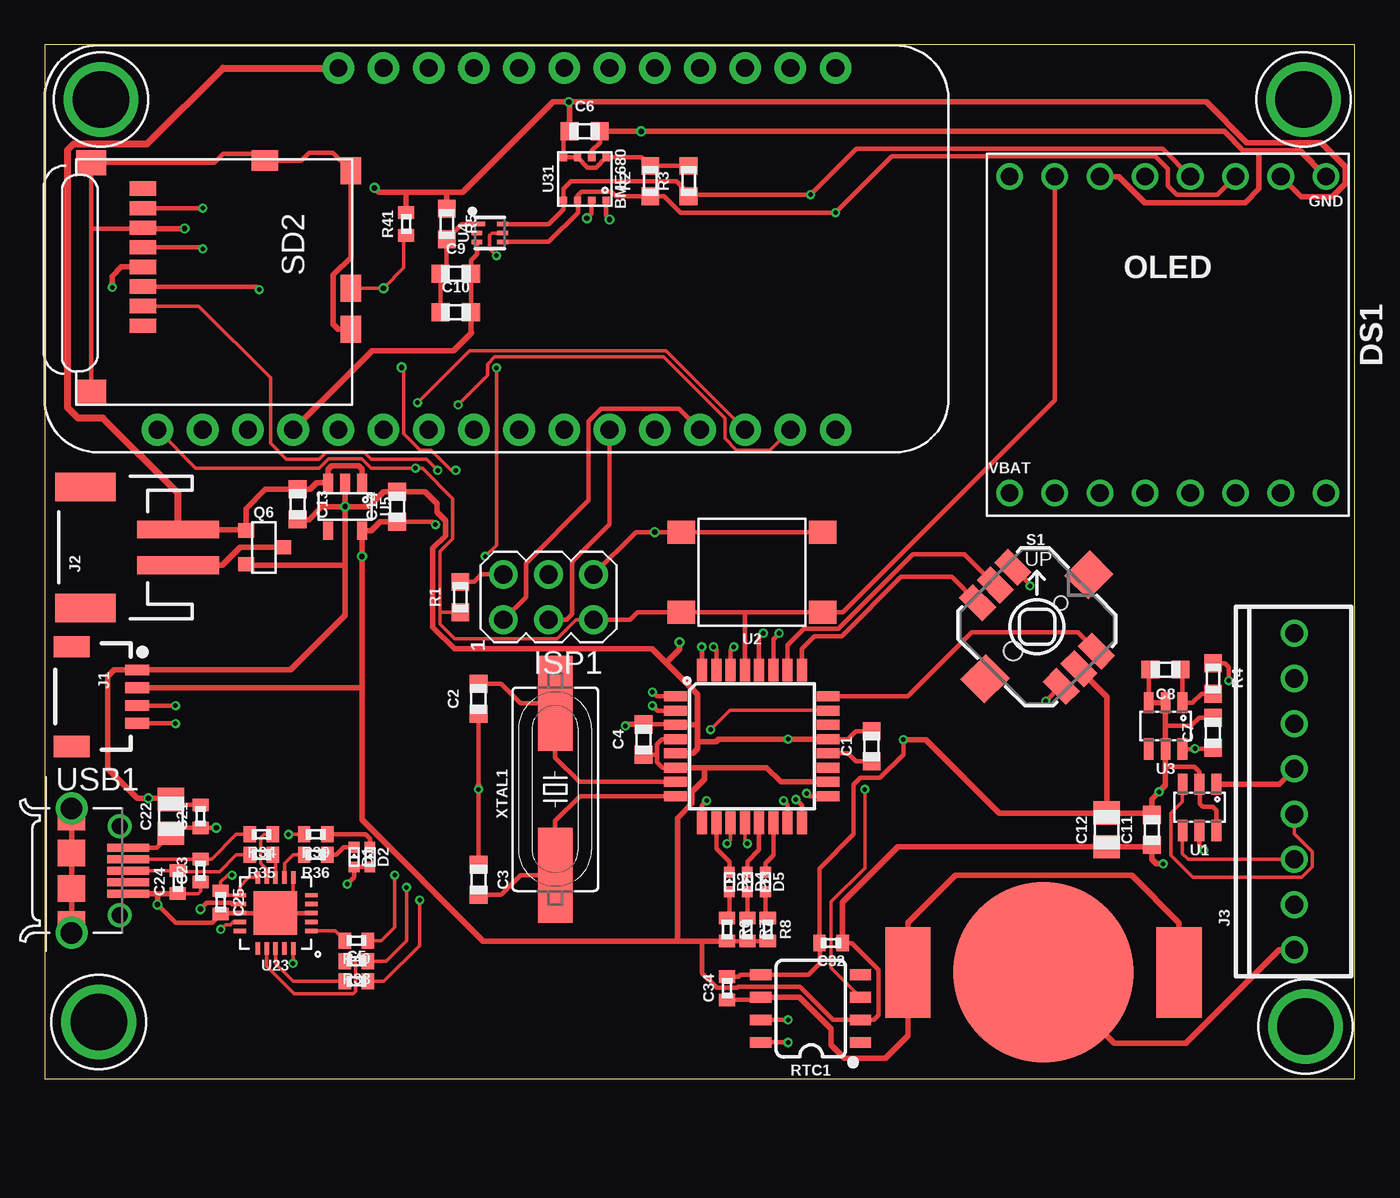
[diagram p1: board, top side]
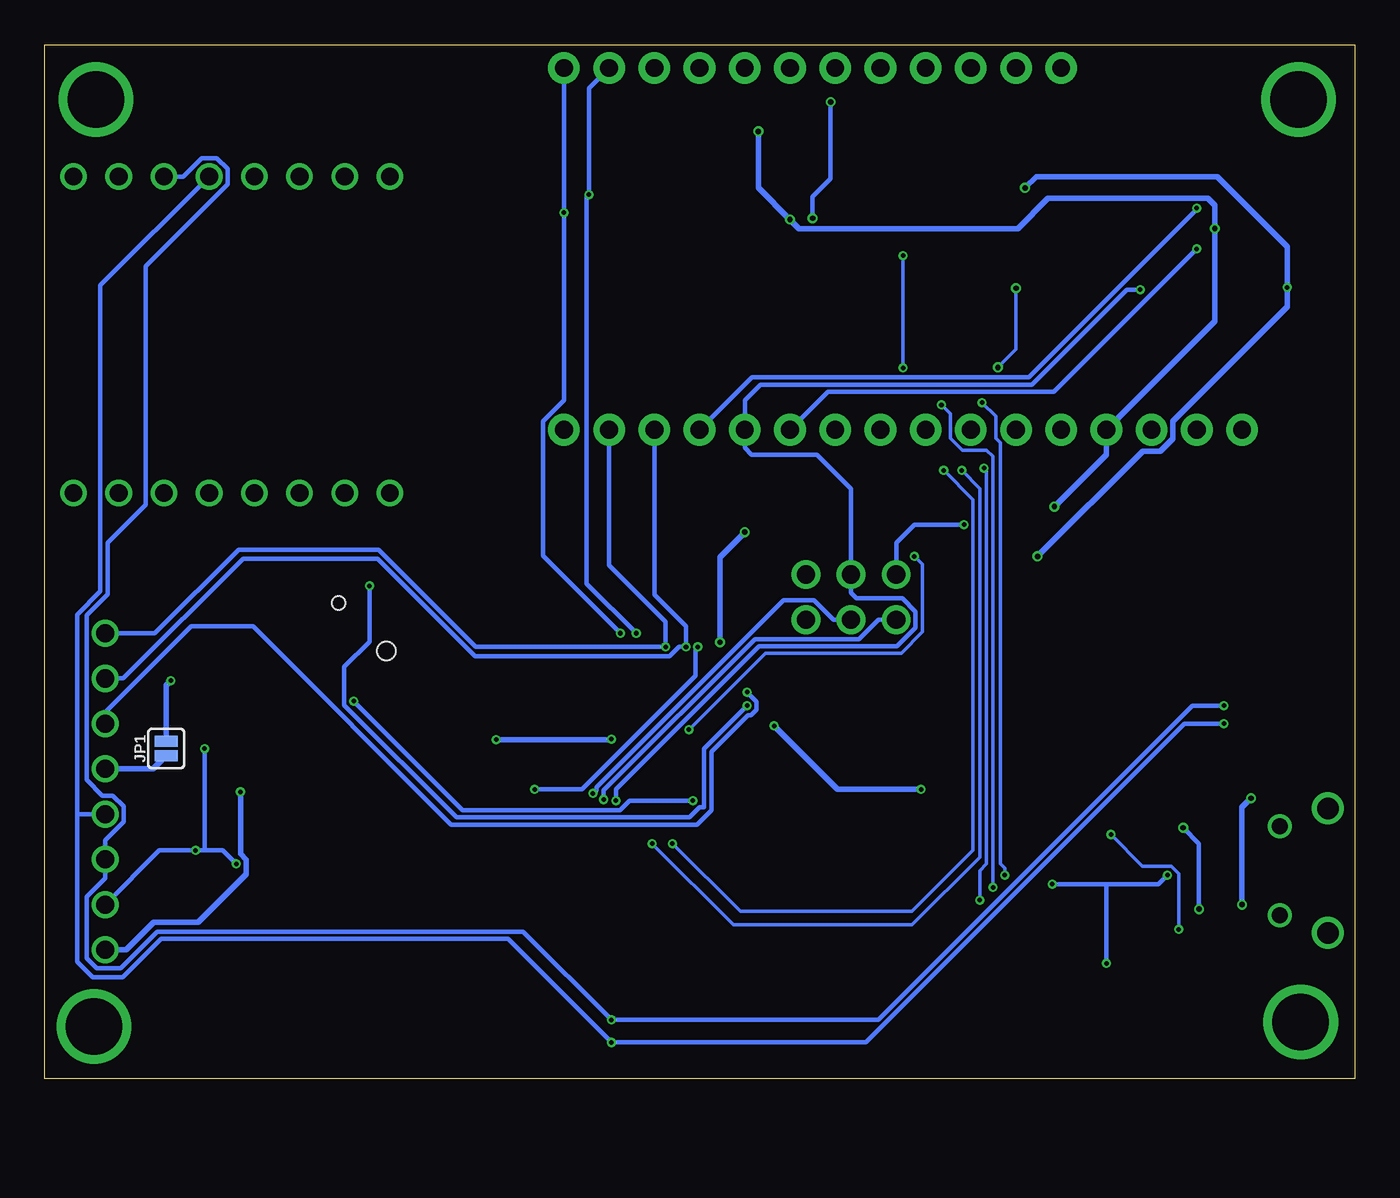
[diagram p2: board, bottom side, seen from below]

Size 73.64 x 58.09 mm. Coordinates in mm from the lower left corner, seen from the top.
Outline: 0,0 73.64,0 73.64,58.09 0,58.09 0,0
Copper layers (1*16): Top 0.035559375mm / dielectric 1.6mm / Bottom 0.035559375mm
Design rules "oshpark-2layer": minimum track width 6mil, minimum drill 10mil, track to track 6mil, track to pad 6mil, pad to pad 6mil, via to via 6mil, smd to smd 6mil, copper to edge 15mil, drill to drill 6mil, minimum pad ring 5mil, minimum via ring 5mil, stop-mask expansion 2.5mil, vias tented up to drill 0mil, thermal gap 10mil

### Footprints (pad centres in the part's own frame; a part is rotated, then mirrored left to right if it is on the bottom)
LINX_BAT-HLD-012-SMT = smd 10.16 x 10.16: GND 0,0 | smd 2.54 x 5.08: POWER0 -7.62,0; POWER1 7.62,0
C0603 = smd 1 x 1: 1 -0.85,0; 2 0.85,0
C0402 = smd 0.7 x 0.9: 1 -0.65,0; 2 0.65,0
C0805 = smd 1.3 x 1.5: 1 -0.95,0; 2 0.95,0
LED_0402 = smd 0.6 x 0.6: ANODE 0.55,0; CATHODE -0.55,0
SPARKFUN_MICRO_OLED = drill 1: CS -8.89,8.89; D0/SCK 1.27,8.89; D1/MOSI 3.81,8.89; D2 -1.27,8.89; D3 -1.27,-8.89; D4 1.27,-8.89; D5 3.81,-8.89; D6 6.35,-8.89; D7 8.89,-8.89; D/C -3.81,8.89; GND 8.89,8.89; RD/E -3.81,-8.89; RESET -6.35,8.89; VBAT -8.89,-8.89; VDD 6.35,8.89; WR/RW -6.35,-8.89
4_40_PLATED = drill 3.175: P$1 0,0
AVRISP = drill 1.02 pad 1.626: 1 -1.27,2.54; 2 1.27,2.54; 3 -1.27,0; 4 1.27,0; 5 -1.27,-2.54; 6 1.27,-2.54
1X04_1MM_RA = smd 0.6 x 1.35: 1 -1.5,0; 2 -0.5,0; 3 0.5,0; 4 1.5,0 | smd 1.2 x 2: NC1 2.8,-3.675; NC2 -2.8,-3.675
JST-2-SMD = smd 1 x 4.6: 1 -1,-3.7; 2 1,-3.7 | smd 1.6 x 3.4: NC1 -3.4,1.5; NC2 3.4,1.5
1X08_SCREW = drill 1.016: 1 -8.89,0; 2 -6.35,0; 3 -3.81,0; 4 -1.27,0; 5 1.27,0; 6 3.81,0; 7 6.35,0; 8 8.89,0
SMT-JUMPER_2_NC_PASTE_SILK = smd 0.635 x 1.27: 1 -0.406,0; 2 0.406,0
FEATHERWING_MIN = drill 1 pad 1.778: 1 6.35,1.27; 2 8.89,1.27; 3 11.43,1.27; 4 13.97,1.27; 5 16.51,1.27; 6 19.05,1.27; 7 21.59,1.27; 8 24.13,1.27; 9 26.67,1.27; 10 29.21,1.27; 11 31.75,1.27; 12 34.29,1.27; 13 36.83,1.27; 14 39.37,1.27; 15 41.91,1.27; 16 44.45,1.27; 17 44.45,21.59; 18 41.91,21.59; 19 39.37,21.59; 20 36.83,21.59; 21 34.29,21.59; 22 31.75,21.59; 23 29.21,21.59; 24 26.67,21.59; 25 24.13,21.59; 26 21.59,21.59; 27 19.05,21.59; 28 16.51,21.59
SOT23-3 = smd 0.8 x 0.9: 1 -0.95,-1; 2 0.95,-1; 3 0,1.1
R0603 = smd 1 x 1: 1 -0.85,0; 2 0.85,0
R0402 = smd 0.7 x 0.9: 1 -0.65,0; 2 0.65,0
SO08 = smd 0.6 x 1.2: 1 -1.905,-2.8; 2 -0.635,-2.8; 3 0.635,-2.8; 4 1.905,-2.8; 5 1.905,2.8; 6 0.635,2.8; 7 -0.635,2.8; 8 -1.905,2.8
JOYSTICK_MINI = smd 1.85 x 1.1: A -3.325,1.4; B 3.325,1.4; C -3.325,-1.4; CTR -3.325,0; D 3.325,-1.4; GND 3.325,0 | smd 1.9 x 2: NC 0,4.13; NC@0 0,-4.13 | hole 0.75: 0,1.9 | hole 1.05: 0,-1.9
SWITCH_6MM = smd 1.55 x 1.3: 1 -3.975,2.25; 2 3.975,2.25; 3 -3.975,-2.25; 4 3.975,-2.25
MICROSD_CD = smd 0.8 x 1.5: 1 4.45,-3.75; 2 5.55,-3.75; 3 6.65,-3.75; 4 7.75,-3.75; 5 8.85,-3.75; 6 9.95,-3.75; 7 11.05,-3.75; 8 12.15,-3.75 | smd 1.5 x 1.15: CD1 6.55,-15.45; MT3 4.25,-15.45; MT4 13.15,-15.45 | smd 1.15 x 1.5: CD2 13.725,-10.6 | smd 1.4 x 1.7: MT1 13.6,-0.85; MT2 0.7,-0.85
SOT23-6L = smd 0.55 x 1.2: 1 -0.95,-1.3; 2 0,-1.3; 3 0.95,-1.3; 4 0.95,1.3; 5 0,1.3; 6 -0.95,1.3
TQFP32-08 = smd 1.27 x 0.559: 1 -4.293,2.8; 2 -4.293,2; 3 -4.293,1.2; 4 -4.293,0.4; 5 -4.293,-0.4; 6 -4.293,-1.2; 7 -4.293,-2; 8 -4.293,-2.8; 17 4.293,-2.8; 18 4.293,-2; 19 4.293,-1.2; 20 4.293,-0.4; 21 4.293,0.4; 22 4.293,1.2; 23 4.293,2; 24 4.293,2.8 | smd 0.559 x 1.27: 9 -2.8,-4.293; 10 -2,-4.293; 11 -1.2,-4.293; 12 -0.4,-4.293; 13 0.4,-4.293; 14 1.2,-4.293; 15 2,-4.293; 16 2.8,-4.293; 25 2.8,4.293; 26 2,4.293; 27 1.2,4.293; 28 0.4,4.293; 29 -0.4,4.293; 30 -1.2,4.293; 31 -2,4.293; 32 -2.8,4.293
ODFN-6 = smd 0.75 x 0.25: 1 -0.645,0.5 | smd 0.6 x 0.25: 2 -0.72,0; 3 -0.72,-0.5; 4 0.72,-0.5; 5 0.72,0; 6 0.72,0.5
SOT23-5 = smd 0.55 x 1: 1 -0.95,-1.35; 2 0,-1.35; 3 0.95,-1.35; 4 0.95,1.35; 5 -0.95,1.35
QFN20 = smd 0.7 x 0.25: 1 -2.032,0.968; 2 -2.032,0.468; 3 -2.032,-0.032; 4 -2.032,-0.532; 5 -2.032,-1.032; 11 1.968,-1.032; 12 1.968,-0.532; 13 1.968,-0.032; 14 1.968,0.468; 15 1.968,0.968 | smd 0.25 x 0.7: 6 -1.032,-2.032; 7 -0.532,-2.032; 8 -0.032,-2.032; 9 0.468,-2.032; 10 0.968,-2.032; 16 0.968,1.968; 17 0.468,1.968; 18 -0.032,1.968; 19 -0.532,1.968; 20 -1.032,1.968 | smd 2.45 x 2.45: EP -0.032,-0.032
BMP680 = smd 0.4 x 0.4: 1 1.2,1.2; 2 1.2,0.4; 3 1.2,-0.4; 4 1.2,-1.2; 5 -1.2,-1.2; 6 -1.2,-0.4; 7 -1.2,0.4; 8 -1.2,1.2
10118194-0001LF_10118194-0001LF_LONGER_PADS = smd 0.45 x 2.35: 1 -1.3,3.175; 2 -0.65,3.175; 3 0,3.175; 4 0.65,3.175; 5 1.3,3.175 | drill 0.9: BBODY@1 -2.5,2.7; BBODY@2 2.5,2.7 | drill 1.2: BODY@1 -3.5,0; BODY@4 3.5,0 | smd 1.5 x 1.55: BODY@2 -1,0; BODY@3 1,0; BODY@7 -3.032,0; BODY@8 3.032,0
HC49UP = smd 5.334 x 1.93: 1 -4.826,0; 2 4.826,0

### Placement (x,y rotation side)
BT1  56.13,5.97 180 top
C1  46.48,18.67 90 top
C2  24.38,21.34 90 top
C3  24.38,11.18 270 top
C4  33.66,19.05 90 top
C5  17.53,5.46 0 top
C6  30.35,53.21 0 top
C7  65.66,19.43 90 top
C8  62.99,22.99 180 top
C9  23.11,45.21 0 top
C10  23.11,43.05 0 top
C11  62.23,13.97 90 top
C12  59.69,13.97 90 top
C13  14.22,32.26 270 top
C14  19.81,32.13 90 top
C21  8.76,14.73 90 top
C22  7.11,14.73 90 top
C23  8.76,11.68 90 top
C24  7.49,11.05 90 top
C25  9.91,9.91 270 top
C32  44.2,7.62 180 top
C34  38.35,5.08 90 top
D1  17.4,12.45 270 top
D2  18.29,12.45 270 top
D3  38.48,11.05 270 top
D4  39.5,11.05 270 top
D5  40.51,11.05 270 top
DS1  63.12,41.78 0 top
H1  3.05,3.17 0 top
H2  3.17,54.99 0 top
H3  70.74,54.99 0 top
H4  70.87,2.92 0 top
ISP1  28.32,27.05 90 top
J1  5.21,21.46 270 top
J2  3.81,29.84 90 top
J3  70.23,16.13 90 top
JP1  66.8,18.54 90 bottom
MS1  0,35.18 0 top
Q6  12.32,29.84 270 top
R1  23.37,27.05 90 top
R2  34.04,50.42 90 top
R3  36.2,50.42 90 top
R4  65.66,22.48 270 top
R5  22.61,48.01 270 top
R6  38.35,8.38 270 top
R7  39.5,8.38 270 top
R8  40.64,8.38 270 top
R34  12.19,13.72 180 top
R35  12.19,12.57 180 top
R36  15.24,12.57 180 top
R38  17.53,6.6 180 top
R39  15.24,13.72 180 top
R40  17.53,7.75 180 top
R41  20.32,48.01 90 top
RTC1  43.05,3.94 90 top
S1  55.77,25.38 315 top
S2  39.75,28.45 0 top
SD2  1.78,37.85 90 top
U1  64.9,15.24 180 top
U2  39.75,18.67 0 top
U3  62.99,19.81 180 top
U4  25.02,47.5 0 top
U5  16.89,32.13 180 top
U23  12.95,9.27 180 top
U31  30.35,50.55 270 top
USB1  1.52,11.68 270 top
XTAL1  28.7,16.26 90 top

### Tracks (layer width: path | path; a pad name or v marks a point on that pad's centre or on a via)
3V3  (via drill 0.25, 0.3)
  Top 0.254: v65.15,12.83 64.9,13.08 U1.5 | U3.6 64.61,18.51 v64.64,18.54 65.62,18.54 C7.1 | R6.2 R7.2 R8.2 | 35.44,19.05 U2.4 34.69,19.07 34.42,18.8 34.42,18.16 | 34.42,18.16 34.42,17.78 34.73,17.47 U2.6 | C4.1 34.38,18.2 34.42,18.16 | R3.2 R2.2 33.56,51.75 U31.8 30.99,51.18 30.52,51.18 U31.6 U31.5 29.15,52.86 C6.1 | 36.96,7.73 36.96,5.93 37.79,5.1 38.92,5.1 38.97,5.15 42.45,5.15 44.3,3.3 RTC1.2 46.61,3.3 46.86,3.56 46.86,6.13 45.37,7.62 C32.1 | U31.2 30.75,48.61 v30.48,48.33 | C14.1 21.8,31.28 v21.97,31.11 | R1.2 24.13,27.9 24.55,28.32 ISP1.2
  Top 0.305: v62.87,12.06 62.48,12.06 62.23,12.32 C11.1 62.13,13.02 C12.1 47.95,13.02 44.85,9.92 C32.1 | C14.1 18.85,31.28 18.35,30.78 U5.5 v17.84,29.34 17.84,21.97 | 35.56,7.73 24.65,7.73 17.84,14.54 17.84,21.97 | 35.56,7.73 36.96,7.73 R6.2 | 35.56,7.73 35.56,14.62 36.4,15.46 36.4,16.13 37.08,16.82 37.08,17.47 | U2.6 37.08,17.47 | 37.08,17.47 40.57,17.47 41.37,16.67 U2.18 | 17.84,21.97 17.83,21.96 J1.2 | v3.81,44.45 3.81,45.09 4.32,45.59 SD2.4 | v29.46,54.86 65.28,54.86 67.56,52.58 71.75,52.58 73.11,51.23 73.11,50.28 72.36,49.53 70.61,49.53 DS1.VDD | C6.1 29.5,54.83 v29.46,54.86 | 20.32,49.78 22.61,49.78 | 22.61,49.78 23.5,49.78 28.57,54.86 v29.46,54.86 | R5.1 22.61,49.78 | R41.2 20.32,49.78 | v18.54,50.04 18.8,49.78 20.32,49.78
  Bottom 0.254: J3.2 67.18,12.83 v65.15,12.83 64.64,12.83 | v62.87,12.06 63.63,12.83 64.64,12.83 | v64.64,18.54 64.64,12.83 | v30.48,48.33 30.48,49.53 29.46,50.55 v29.46,54.86 | ISP1.2 25.78,30.09 24.76,31.11 v21.97,31.11
  Bottom 0.305: v17.84,29.34 11.92,35.26 10.94,35.26 10.24,35.95 10.24,36.94 3.81,43.37 v3.81,44.45 3.81,46.74 7.75,50.67 17.91,50.67 v18.54,50.04
3V3_FTDI  (via drill 0.25)
  Top 0.2: U23.10 11.48,11.3 10.99,10.81 U23.11 10.16,10.3 C25.1 9.91,11.05 10.29,11.43 v10.54,11.43 | v13.97,6.48 13.99,6.49 U23.20
  Top 0.254: D2.ANODE D1.ANODE 17.4,11.3 v17.02,10.92
  Bottom 0.254: v17.02,10.92 13.97,10.92 | 13.97,10.92 11.05,10.92 v10.54,11.43 | v13.97,6.48 13.97,10.92
AIN
  Top 0.305: U1.1 69.37,16.54 J3.5
  Bottom 0.305: JP1.1 67.54,17.4 J3.5
DTR
  Top 0.2: C5.1 13.97,5.46 12.99,6.45 U23.18
GND  (via drill 0.25, 0.3)
  Top 0.2: 7.48,10.38 C24.1 8.64,10.4 8.76,10.53 C23.1 | U23.6 13.99,10.3 U23.EP 12.83,9.3
  Top 0.254: C22.2 7.41,15.38 C21.2 | 7.63,10.41 7.62,10.4 C24.1 7.51,10.41 | v6.35,9.78 7.37,8.76 9.41,8.76 C25.2 9.95,9.3 U23.13 12.83,9.3 U23.3 | U3.5 63.01,18.5 | C7.2 64.9,20.28 64.43,19.81 62.99,19.81 | C8.2 62.04,22.89 U3.3 | U1.6 65.85,15.08 65.65,15.28 65.08,15.28 64.91,15.44 64.91,16.52 U1.2 64.9,17.24 64.61,17.53 62.99,17.53 | C2.1 24.38,16.51 | v24.38,16.26 C3.1 | C1.2 45.59,19.52 45.14,19.07 U2.21 | C4.2 35.43,19.9 U2.3 | ISP1.6 33.24,30.7 v34.29,30.7 S2.1 S2.2 | C6.2 31.2,52.58 30.75,52.13 U31.7 | C10.2 C9.2 23.96,45.97 24.3,46.31 U4.3 | C34.2 38.99,5.73 39.1,5.84 RTC1.5 42.93,5.84 43.56,6.48 43.56,7.61 C32.2 43.55,11.8 45.47,13.72 45.47,16.51 45.85,16.89 46.95,16.89 48.26,18.2 v48.26,19.05 | 2.63,47.75 SD2.MT1 9.54,51.45 10.03,51.94 12.01,51.94 SD2.CD2 | 2.63,47.75 SD2.MT2 | SD2.6 5.48,47.75 2.63,47.75 | SD2.CD2 14.42,51.57 14.88,52.02 16.2,52.02 SD2.MT4 | SD2.CD2 12.25,51.45 | U31.1 31.55,48.46 v31.75,48.26
  Top 0.305: USB1.5 6.35,10.38 | 6.35,10.38 7.48,10.38 | 6.35,10.38 v6.35,9.78 | C22.2 7.05,15.75 v5.84,15.75 5.21,15.75 3.56,17.4 3.56,22.61 3.91,22.96 J1.1 13.82,22.96 16.89,26.04 16.89,28.83 | U3.3 U3.2 62.99,19.81 U3.5 62.99,17.53 62.99,16.47 v62.63,16.11 62.23,15.71 C11.2 62.13,14.92 C12.2 | C13.2 14.86,31.41 15.58,32.13 v16.89,32.13 | v16.89,32.13 18.2,32.13 19.05,32.98 C14.2 21.38,32.98 22.07,32.28 22.07,31.8 22.53,31.35 22.53,30.5 21.82,29.79 21.82,25.37 23.03,24.16 34.14,24.16 34.92,23.37 | U5.2 v16.89,32.13 | 24.38,16.51 v24.38,16.26 | v32.64,19.81 32.73,19.9 C4.2 | Q6.2 11.38,28.83 16.89,28.83 | U2.5 36.43,18.27 36.7,18.54 36.7,18.92 | 36.7,18.92 36.7,19.94 | 36.7,19.94 36.7,21.59 34.92,23.37 | U2.3 36.63,19.87 36.7,19.94 | U2.21 v41.78,19.07 37.87,19.07 37.72,18.92 36.7,18.92 | C12.2 53.66,14.92 49.53,19.05 v48.26,19.05 | C12.2 59.69,21.46 S1.GND | v7.87,47.75 5.48,47.75 | C6.2 v33.53,53.21 66.28,53.21 67.38,52.12 68.24,52.12 | DS1.GND 70.56,52.12 68.24,52.12 | DS1.D/C 60.36,50.67 61.82,49.21 67.47,49.21 68.24,49.98 68.24,52.12 | v16.89,32.13 16.89,28.83 | v35.69,24.51 35.69,24.13 34.92,23.37 | MS1.4 18.41,40.89 22.99,40.89 24,41.91 23.96,41.95 C10.2 | SD2.MT4 17.23,46.15 16.22,45.15 16.22,42.38 16.5,42.1 SD2.MT3 | J3.1 69.39,7.24 64.13,1.98 60.12,1.98 BT1.GND
  Bottom 0.305: v6.35,9.78 6.35,15.24 v5.84,15.75 | v24.38,16.26 29.08,16.26 v32.64,19.81 | v62.63,16.11 62.63,12.62 62.31,12.3 62.31,11.48 65,8.79 67.51,8.79 69.05,7.24 J3.1 | v48.26,19.05 41.8,19.05 v41.78,19.07 | v16.89,32.13 13.97,35.05 MS1.4 7.87,42.55 v7.87,47.75 7.87,49.05 8.28,49.45 17.25,49.45 18.95,47.75 31.24,47.75 v31.75,48.26 33.53,50.04 v33.53,53.21 | v34.29,30.7 35.69,29.3 v35.69,24.51
IMU_INT  (via drill 0.25)
  Top 0.2: U4.5 25.15,47.5 25.02,47.37 25.02,46.61 v25.4,46.23 | U2.23 44.01,20.7 38.53,20.7 v37.43,19.6 | v25.4,39.93 25.4,29.97 v24.77,29.34
  Bottom 0.2: v24.77,29.34 24.31,28.88 24.31,25.09 25.5,23.9 33.13,23.9 v37.43,19.6 | v25.4,46.23 v25.4,39.93
INT  (via drill 0.25)
  Top 0.254: U2.1 34.41,21.47 v34.16,21.72
  Bottom 0.254: v34.16,21.72 34.16,21.71 33.63,21.18 33.63,20.73 33.94,20.42 34.12,20.42 36.17,18.37 36.17,15.07 36.97,14.28 50.78,14.28 61.91,25.4 65.41,25.4 70.23,20.57 J3.6
JOY_DOWN  (via drill 0.25)
  Top 0.254: U2.9 36.95,15.36 v37.21,15.62 | v56.26,21.21 57.09,22.04 S1.D
  Bottom 0.254: v37.21,15.62 40.77,15.62 41.31,15.09 50.14,15.09 v56.26,21.21
JOY_LEFT
  Top 0.254: U2.25 42.55,24.14 43.28,24.86 44.8,24.86 48.13,28.19 50.98,28.19 S1.C
JOY_PUSH
  Top 0.254: U2.26 41.75,24.35 42.67,25.27 44.62,25.27 48.81,29.46 51.69,29.46 S1.CTR
JOY_RIGHT
  Top 0.254: U2.24 48.52,21.47 52.12,25.07 58.06,25.07 S1.B
JOY_UP  (via drill 0.25)
  Top 0.254: U2.2 34.45,20.67 v34.16,20.95 | v55.37,27.69 55.37,27.76 S1.A
  Bottom 0.254: v34.16,20.95 36.58,18.54 36.58,15.24 36.84,15.24 37.4,14.68 50.49,14.68 56.79,20.99 56.79,23.13 55.37,24.55 v55.37,27.69
LED_BLUE
  Top 0.254: U2.14 40.95,12.54 40.51,12.11 D5.CATHODE
LED_GREEN
  Top 0.254: U2.13 40.15,12.85 39.5,12.19 D4.CATHODE
LED_RED
  Top 0.254: U2.10 37.75,12.92 38.48,12.19 D3.CATHODE
MISO  (via drill 0.25)
  Top 0.254: U2.16 42.55,15.35 v42.22,15.68 | MS1.13 35.66,37.62 31.27,37.62 30.58,36.93 30.58,32.48 27.05,28.95 27.05,27.05 ISP1.1 | v8.89,48.9 SD2.7
  Bottom 0.254: v42.22,15.68 42.22,16.19 33.72,24.69 27.87,24.69 26.78,25.78 ISP1.1 | MS1.13 33.88,39.4 18.33,39.4 8.89,48.84 v8.89,48.9
MOSI  (via drill 0.25)
  Top 0.254: U2.15 41.75,15.4 v41.53,15.62 | SD2.3 11.89,44.5 v12.06,44.32
  Bottom 0.254: v41.53,15.62 41.53,16.26 33.5,24.28 25.73,24.28 24.69,25.33 24.69,26.23 25.43,26.98 28.01,26.98 28.32,27.28 ISP1.4 28.32,33.15 30.23,35.05 33.91,35.05 34.29,35.43 MS1.12 34.29,38.1 33.4,38.99 18.16,38.99 12.83,44.32 v12.06,44.32
N$1
  Top 0.305: USB1.BODY@1 USB1.BODY@7 USB1.BODY@2 USB1.BODY@3 USB1.BODY@8 USB1.BODY@4
N$2  (via drill 0.25)
  Top 0.254: v66.55,22.35 66.55,23.11 66.33,23.33 R4.1
  Bottom 0.305: v66.55,22.35 66.8,22.1 JP1.2
N$3
  Top 0.254: U4.1 23.45,48 R5.2 22.61,45.55 C9.1 C10.1
N$5
  Top 0.254: C1.1 45.59,17.82 45.14,18.27 U2.20
N$7
  Top 0.254: U2.8 30.1,15.88 28.7,14.48 XTAL1.1 26.76,11.43 25.65,10.33 C3.2
N$8
  Top 0.254: U2.7 30.07,16.67 28.7,18.03 XTAL1.2 26.76,21.08 25.65,22.19 C2.2
N$10
  Top 0.254: D3.ANODE 38.48,9.16 R6.1
N$11
  Top 0.254: D4.ANODE R7.1
N$12
  Top 0.254: D5.ANODE 40.51,9.16 R8.1
N$43
  Top 0.254: RTC1.6 40.11,4.43 C34.1
  Top 0.305: RTC1.6 42.42,4.57 44.2,2.79 44.2,1.91 44.96,1.14 47.24,1.14 48.51,2.41 BT1.POWER1 48.51,8.76 51.18,11.43 61.09,11.43 63.75,8.76 BT1.POWER0
N$44
  Top 0.2: U23.17 12.49,6.31 14.04,4.76 17.33,4.76 17.48,4.91 17.48,6.52 17.4,6.6 R38.2
N$47
  Top 0.2: U23.1 16.32,8.3 R40.2
N$48
  Top 0.2: R35.2 10.78,12.57 9.84,11.64 7.56,11.64 C24.2 7.48,11.68 USB1.3
N$49
  Top 0.2: USB1.2 C23.2 9.4,12.33 10.78,13.72 R34.2
N$50
  Top 0.2: R35.1 12.99,12.43 U23.8
N$51  (via drill 0.25)
  Top 0.2: v9.91,8.38 10.18,8.65 10.46,8.65 10.61,8.8 U23.14 | v13.72,13.72 R39.2
  Bottom 0.2: v13.72,13.72 11.94,11.94 10.33,11.94 9.91,11.51 v9.91,8.38
N$52
  Top 0.2: R34.1 12.33,13.72 12.14,13.53 12.14,12.1 12.49,11.76 U23.9
N$53
  Top 0.254: D2.CATHODE 18.29,13.48 18.05,13.72 R39.1
N$54
  Top 0.254: D1.CATHODE 16.81,13 16.38,12.57 R36.1
N$57
  Top 0.2: R36.2 13.97,12.57 13.49,12.09 U23.7
RESET  (via drill 0.25)
  Top 0.2: C5.2 19.07,5.46 21.08,7.48 v21.08,10.03 | MS1.1 8.51,34.29 15.43,34.29 15.96,34.82 17.82,34.82 18.35,34.29 v20.85,34.29 21.23,34.29 22.93,32.59 22.93,30.34 22.22,29.62 22.22,26.16 | ISP1.5 29.87,25.78 28.81,24.72 23.04,24.72 22.22,25.54 22.22,26.16 | R1.1 22.26,26.2 22.22,26.16
  Top 0.254: 39.37,26.2 S2.4 44.87,26.2 56.77,38.1 DS1.RESET | 39.37,26.2 S2.3 | S2.3 35.65,26.07 | U2.29 39.35,26.18 39.37,26.2 | S2.3 33.31,26.2 32.89,25.78 ISP1.5
  Bottom 0.2: v21.08,10.03 21.08,11.68 20.7,12.06 20.7,34.14 v20.85,34.29
RTC_INT  (via drill 0.25)
  Top 0.2: RTC1.3 44.2,6.23 44.2,9.92 46.1,11.83 v46.1,16.26
  Top 0.254: v36.93,24.26 36.95,24.24 U2.32
  Bottom 0.254: v46.1,16.26 43.44,16.26 37.06,22.64 37.06,24.13 v36.93,24.26
RX  (via drill 0.25)
  Top 0.2: R38.1 19.19,6.6 20.34,7.76 v20.34,10.74 | v23.24,37.85 24.89,39.5 24.89,40.14 25.3,40.54 34.78,40.54 38.23,37.09 38.23,35.98 38.9,35.31 40.77,35.31 MS1.15
  Top 0.254: U2.30 38.55,24.07 v38.73,24.26
  Bottom 0.2: v20.34,10.74 20.34,34.95 20.7,35.31 22.06,35.31 22.73,35.98 22.73,37.34 v23.24,37.85
  Bottom 0.254: J3.8 67.44,25.02 62.74,29.72 54.86,29.72 49.4,24.26 v38.73,24.26 38.73,25.65 41.91,28.83 MS1.15
SCK  (via drill 0.25)
  Top 0.254: U2.17 42.97,15.87 v42.82,16.02 | v8.89,46.61 8.8,46.7 SD2.5 | ISP1.3 29.34,25.78 29.64,26.09 29.64,29.03 31.75,31.14 MS1.11
  Bottom 0.254: v42.82,16.02 42.63,16.21 42.63,16.36 32.11,26.87 30.41,26.87 29.32,25.78 ISP1.3 | MS1.11 29.62,38.58 16.92,38.58 v8.89,46.61
SCL  (via drill 0.25)
  Top 0.2: J3.4 70.23,13.75 71.25,12.74 71.25,11.9 70.65,11.3 64.52,11.3 63.29,12.54 63.29,14.9 63.95,15.55 U1.3
  Top 0.254: U2.28 40.15,24.78 v40.39,25.02 | U4.6 28.31,48 29.15,48.84 U31.4 29.15,49.98 29.59,50.42 35.52,50.42 36.28,49.66 | DS1.D0/SCK 62.84,52.22 45.62,52.22 v43.05,49.66 36.28,49.66 | 36.28,49.66 R3.1 | RTC1.8 v41.78,2.03 | J1.4 7.34,19.96 v7.37,19.94
  Bottom 0.254: v40.39,25.02 43.18,27.81 43.18,49.53 v43.05,49.66 43.05,55.63 MS1.18 | v7.37,19.94 9.58,19.94 27.48,2.03 v41.78,2.03 47.6,7.85 67.08,7.85 69.24,5.69 70.92,5.69 71.81,6.58 71.81,14.86 | DS1.D0/SCK 70.5,44.56 70.5,27.37 71.81,26.06 71.81,14.86 | J3.4 71.81,14.86
SD_CD  (via drill 0.25, 0.3)
  Top 0.2: v23.11,34.16 22.86,34.16 21.71,35.31 21.12,35.31 20.19,36.23 20.19,39.83 v20.07,39.95 | v38.35,13.21 38.55,13.4 U2.11 | R41.1 20.19,47.23 20.19,45.54 v19.05,44.4 SD2.CD1
  Bottom 0.2: v23.11,34.16 21.46,32.51 21.46,12.83 24.89,9.4 34.54,9.4 v38.35,13.21 | v20.07,39.95 19.05,40.97 v19.05,44.4
SD_CS  (via drill 0.25)
  Top 0.2: v22.1,34.16 21.46,34.8 18.34,34.8 17.97,35.17 15.81,35.17 15.44,34.8 13.59,34.8 12.7,35.69 12.7,39.37 8.67,43.4 SD2.2 | v39.5,13.21 39.35,13.35 U2.12
  Bottom 0.2: v22.1,34.16 21.08,33.15 21.08,12.45 24.89,8.64 34.92,8.64 v39.5,13.21
SDA  (via drill 0.25)
  Top 0.2: J3.3 64.26,12.32 63.95,12.63 U1.4
  Top 0.254: U2.27 40.95,24.7 v41.27,25.02 | U4.4 28.33,47 29.97,48.64 29.97,49.33 U31.3 29.95,49.6 30.18,49.83 30.48,49.83 31.87,49.83 32.12,49.57 R2.1 34.8,49.57 35.73,48.64 v44.45,48.64 47.62,51.82 62.42,51.82 63.13,51.1 63.13,50.15 63.64,49.64 65.9,49.64 DS1.D1/MOSI | RTC1.7 v41.78,3.3 | v7.37,20.95 J1.3
  Bottom 0.254: v41.27,25.02 45.62,29.36 45.62,36.93 44.45,38.1 v44.45,48.64 MS1.17 | v7.37,20.95 9.14,20.95 26.79,3.3 v41.78,3.3 46.74,8.26 67.31,8.26 69.37,6.2 70.71,6.2 71.27,6.76 71.27,10.21 70.23,11.25 J3.3 70.23,13.39 69.19,14.43 69.19,15.29 69.8,15.9 70.38,15.9 71.27,16.79 71.27,26.02 70.09,27.2 70.09,30.11 67.96,32.24 67.96,45.65 63.36,50.25 63.36,51.1 63.96,51.7 64.81,51.7 65.84,50.67 DS1.D1/MOSI
TX  (via drill 0.25)
  Top 0.2: R40.1 18.92,7.75 19.68,8.51 v19.68,11.43 | v20.95,37.97 23.88,40.89 34.92,40.89 MS1.14
  Top 0.254: U2.31 37.75,24.1 v37.59,24.26
  Bottom 0.2: v19.68,11.43 19.68,11.81 19.94,12.06 19.94,35.72 20.19,35.98 20.19,37.21 v20.95,37.97
  Bottom 0.254: J3.7 69.22,22.48 62.48,29.21 54.93,29.21 49.44,23.72 38.51,23.72 37.98,24.26 v37.59,24.26 37.59,25.4 39.37,27.18 MS1.14
VIN+
  Top 0.305: J2.2 11.27,30.84 Q6.1 11.32,32.02 12.41,33.11 C13.1 14.93,33.11 15.31,33.48 U5.3 15.94,34.23 16.13,34.42 17.65,34.42 17.84,34.23 U5.1
  Top 0.406: J2.2 7.51,32.88 3.28,37.11 1.89,37.11 1.29,37.7 1.29,52.17 1.63,52.5 5.77,52.5 10.03,56.77 MS1.28
VIN-
  Top 0.305: J2.1 9.99,28.84 10.99,29.84 Q6.3
VREF
  Top 0.254: C8.1 63.94,22.89 U3.1 64.51,21.11 65.02,21.63 R4.2
VUSB  (via drill 0.3)
  Top 0.254: USB1.1 6.31,12.98 C22.1 7.41,14.08 C21.1 9.64,14.08 v9.65,14.1 | U23.12 10.55,9.8 10.47,9.88 9.12,9.88 v8.76,9.53
  Bottom 0.254: v8.76,9.53 8.76,13.21 v9.65,14.1